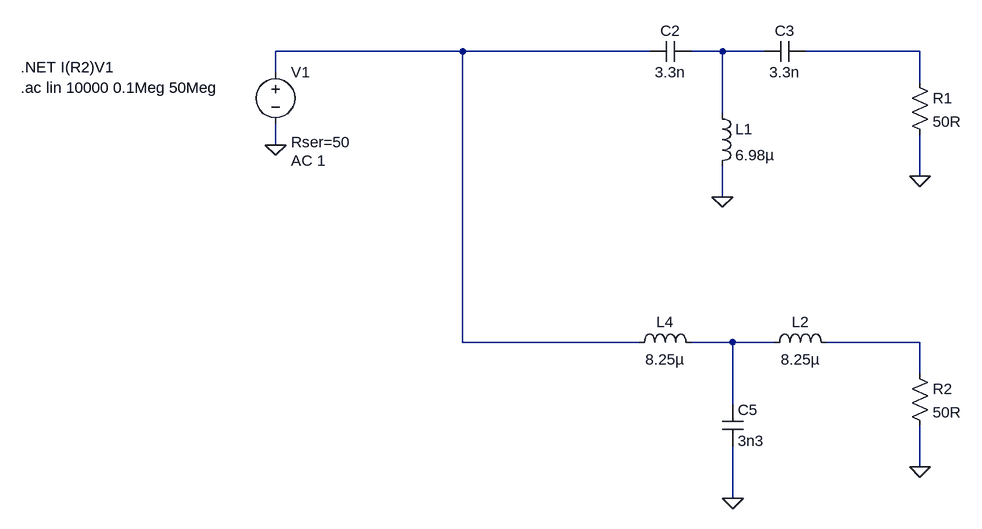
[diagram p0: schematic wspr_si5351_diplexer_simpler.asc]
wspr_si5351_diplexer_simpler.asc, the LTspice schematic file:
Version 4
SHEET 1 1552 900
WIRE 224 112 -64 112
WIRE 512 112 224 112
WIRE 624 112 576 112
WIRE 688 112 624 112
WIRE 928 112 752 112
WIRE -64 144 -64 112
WIRE 928 160 928 112
WIRE 624 208 624 112
WIRE -64 256 -64 224
WIRE 928 304 928 240
WIRE 624 336 624 288
WIRE 224 560 224 112
WIRE 496 560 224 560
WIRE 640 560 576 560
WIRE 704 560 640 560
WIRE 928 560 784 560
WIRE 928 608 928 560
WIRE 640 656 640 560
WIRE 928 752 928 688
WIRE 640 800 640 720
FLAG -64 256 0
FLAG 928 304 0
FLAG 928 752 0
FLAG 624 336 0
FLAG 640 800 0
SYMBOL voltage -64 128 R0
WINDOW 123 24 152 Left 2
WINDOW 39 24 124 Left 2
SYMATTR Value2 AC 1
SYMATTR SpiceLine Rser=50
SYMATTR InstName V1
SYMATTR Value ""
SYMBOL res 912 144 R0
SYMATTR InstName R1
SYMATTR Value 50R
SYMBOL res 912 592 R0
SYMATTR InstName R2
SYMATTR Value 50R
SYMBOL cap 576 96 R90
WINDOW 0 0 32 VBottom 2
WINDOW 3 32 32 VTop 2
SYMATTR InstName C2
SYMATTR Value 3.3n
SYMBOL cap 752 96 R90
WINDOW 0 0 32 VBottom 2
WINDOW 3 32 32 VTop 2
SYMATTR InstName C3
SYMATTR Value 3.3n
SYMBOL ind 608 192 R0
SYMATTR InstName L1
SYMATTR Value 6.98µ
SYMBOL ind 480 576 R270
WINDOW 0 32 56 VTop 2
WINDOW 3 5 56 VBottom 2
SYMATTR InstName L4
SYMATTR Value 8.25µ
SYMBOL cap 624 656 R0
SYMATTR InstName C5
SYMATTR Value 3n3
SYMBOL ind 688 576 R270
WINDOW 0 32 56 VTop 2
WINDOW 3 5 56 VBottom 2
SYMATTR InstName L2
SYMATTR Value 8.25µ
TEXT -456 168 Left 2 !.ac lin 10000 0.1Meg 50Meg
TEXT -456 136 Left 2 !.NET I(R2)V1

The netlist it stands for:
* wspr_si5351_diplexer_simpler.asc
V1 N001 0 AC 1 Rser=50
R1 N003 0 50R
R2 N005 0 50R
C2 N002 N001 3.3n
C3 N003 N002 3.3n
L1 N002 0 6.98µ
L4 N001 N004 8.25µ
C5 N004 0 3n3
L2 N004 N005 8.25µ
.ac lin 10000 0.1Meg 50Meg
.NET I(R2)V1
.backanno
.end